# EAGLE design Adafruit ItsyBitsy M0 (EAGLE 6.4)
COMPANY: ADAFRUIT INDUSTRIES; DRAWN: KTOWN; REV: B
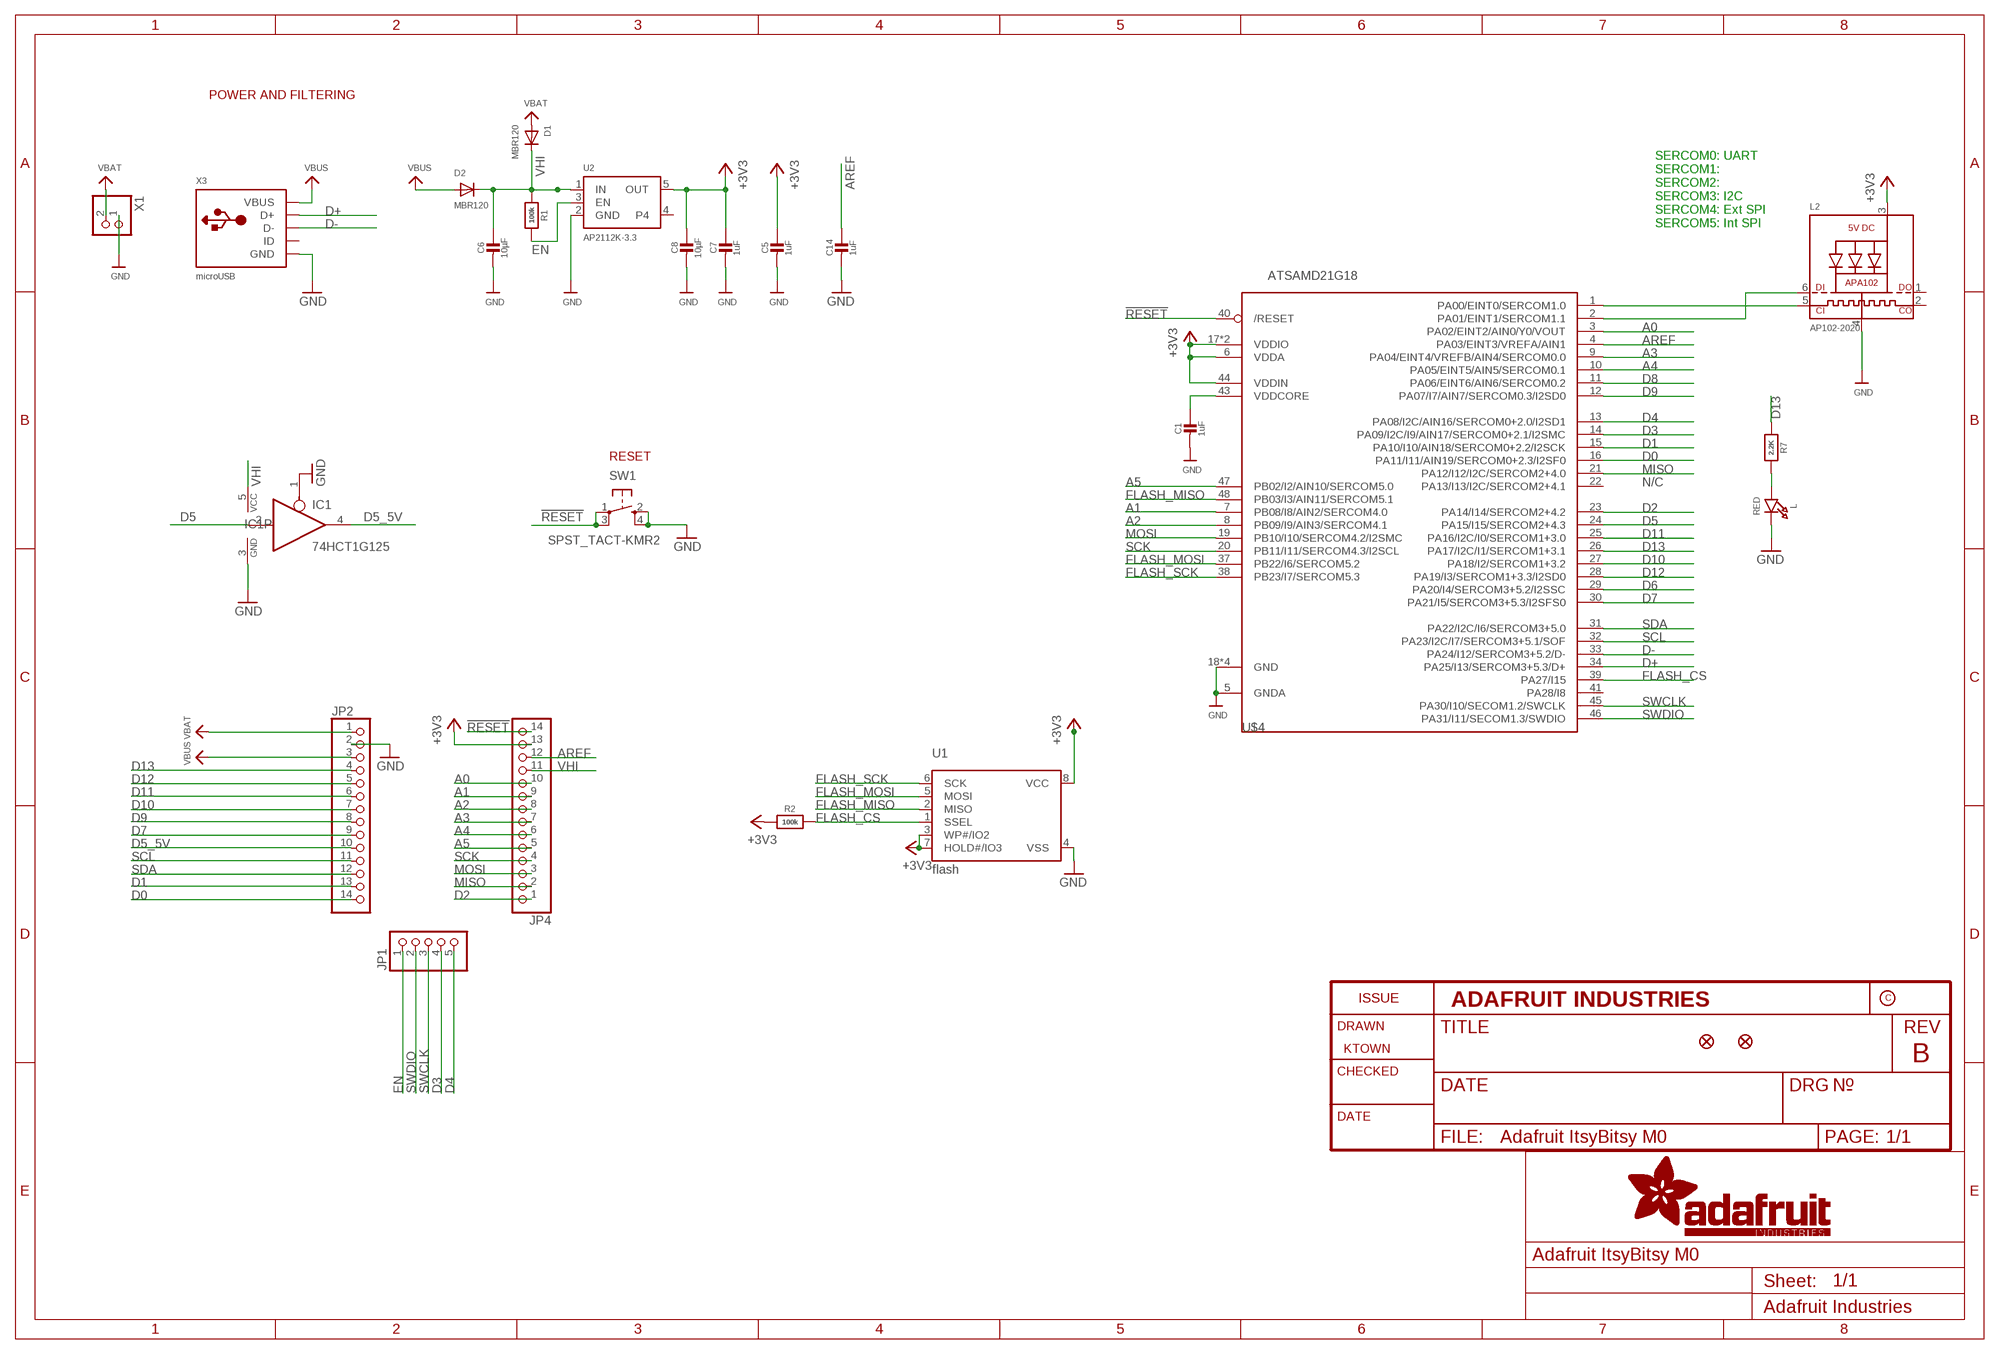
[diagram p0: schematic, sheet 1]

## Parts
C1  1uF  CAP_CERAMIC0603_NO  [0603-NO]
C5  1uF  CAP_CERAMIC0603_NO  [0603-NO]
C6  10µF  CAP_CERAMIC0805-NOOUTLINE  [0805-NO]
C7  1uF  CAP_CERAMIC0603_NO  [0603-NO]
C8  10µF  CAP_CERAMIC0805-NOOUTLINE  [0805-NO]
C14  1uF  CAP_CERAMIC0603_NO  [0603-NO]
D1  MBR120  DIODE_SOD-123FL  [SOD-123FL]
D2  MBR120  DIODE_SOD-123FL  [SOD-123FL]
IC1  74HCT1G125  74AHC1G125DBV  [SOT23-5]
JP1  HEADER-1X570MIL  [1X05_ROUND_70]
JP2  HEADER-1X14  [1X14_ROUND70]
JP4  HEADER-1X14  [1X14_ROUND70]
L  RED  LED0805_NOOUTLINE  [CHIPLED_0805_NOOUTLINE]
L2  AP102-2020  APA1022020  [APA102_2020]
R1  100k  RESISTOR_0603_NOOUT  [0603-NO]
R2  100k  RESISTOR_0603_NOOUT  [0603-NO]
R7  2.2K  RESISTOR_0603_NOOUT  [0603-NO]
SW1  SPST_TACT-KMR2  [KMR2]
U1  flash  SPIFLASH_8PINUX  [USON8]
U2  AP2112K-3.3  VREG_SOT23-5  [SOT23-5]
U$4  ATSAMD21G18  ATSAMD21G_QFN  [TQFN48_7MM]
U$34  FIDUCIAL_1MM  [FIDUCIAL_1MM]
U$35  FIDUCIAL_1MM  [FIDUCIAL_1MM]
X1  CON_JST_PH_2PIN  [JSTPH2]
X3  microUSB  USB_MICRO_20329_V2  [4UCONN_20329_V2]

## Nets
!RESET: JP4.14 SW1.1(P) SW1.3(P1) U$4.40(/RESET)
+3V3: C5.1 C7.1 C8.1 JP4.13 L2.3(VDD) R2.1 U1.3(WP#/IO2) U1.7(HOLD#/IO3) U1.8(VCC) U2.5(OUT) U$4.6(VDDA) U$4.17(VDDIO) U$4.36(VDDIO) U$4.44(VDDIN)
A0: JP4.10 U$4.3(PA02/EINT2/AIN0/Y0/VOUT)
A1: JP4.9 U$4.7(PB08/I8/AIN2/SERCOM4.0)
A2: JP4.8 U$4.8(PB09/I9/AIN3/SERCOM4.1)
A3: JP4.7 U$4.9(PA04/EINT4/VREFB/AIN4/SERCOM0.0)
A4: JP4.6 U$4.10(PA05/EINT5/AIN5/SERCOM0.1)
A5: JP4.5 U$4.47(PB02/I2/AIN10/SERCOM5.0)
AREF: C14.1 JP4.12 U$4.4(PA03/EINT3/VREFA/AIN1)
D0: JP2.14 U$4.16(PA11/I11/AIN19/SERCOM0+2.3/I2SF0)
D1: JP2.13 U$4.15(PA10/I10/AIN18/SERCOM0+2.2/I2SCK)
D2: JP4.1 U$4.23(PA14/I14/SERCOM2+4.2)
D3: JP1.4 U$4.14(PA09/I2C/I9/AIN17/SERCOM0+2.1/I2SMC)
D4: JP1.5 U$4.13(PA08/I2C/AIN16/SERCOM0+2.0/I2SD1)
D5: IC1.2(I) U$4.24(PA15/I15/SERCOM2+4.3)
D5_5V: IC1.4(O) JP2.10
D6: U$4.29(PA20/I4/SERCOM3+5.2/I2SSC)
D7: JP2.9 U$4.30(PA21/I5/SERCOM3+5.3/I2SFS0)
D8: U$4.11(PA06/EINT6/AIN6/SERCOM0.2)
D9: JP2.8 U$4.12(PA07/I7/AIN7/SERCOM0.3/I2SD0)
D10: JP2.7 U$4.27(PA18/I2/SERCOM1+3.2)
D11: JP2.6 U$4.25(PA16/I2C/I0/SERCOM1+3.0)
D12: JP2.5 U$4.28(PA19/I3/SERCOM1+3.3/I2SD0)
D13: JP2.4 R7.1 U$4.26(PA17/I2C/I1/SERCOM1+3.1)
D+: U$4.34(PA25/I13/SERCOM3+5.3/D+) X3.D+
D-: U$4.33(PA24/I12/SERCOM3+5.2/D-) X3.D-
EN: JP1.1 R1.2 U2.3(EN)
FLASH_CS: R2.2 U1.1(SSEL) U$4.39(PA27/I15)
FLASH_MISO: U1.2(MISO) U$4.48(PB03/I3/AIN11/SERCOM5.1)
FLASH_MOSI: U1.5(MOSI) U$4.37(PB22/I6/SERCOM5.2)
FLASH_SCK: U1.6(SCK) U$4.38(PB23/I7/SERCOM5.3)
GND: C1.2 C5.2 C6.2 C7.2 C8.2 C14.2 IC1.1(OE) IC1.3(GND) JP2.2 L2.4(GND) L.C SW1.2(S) SW1.4(S1) U1.4(VSS) U2.2(GND) U$4.5(GNDA) U$4.18(GND) U$4.35(GND) U$4.42(GND) U$4.THERMAL(GND) X1.1 X3.BASE@1(GND) X3.BASE@2(GND) X3.GND X3.SPRT@1(GND) X3.SPRT@2(GND) X3.SPRT@3(GND) X3.SPRT@4(GND)
MISO: JP4.2 U$4.21(PA12/I12/I2C/SERCOM2+4.0)
MOSI: JP4.3 U$4.19(PB10/I10/SERCOM4.2/I2SMC)
N$1: L2.5(CKI) U$4.1(PA00/EINT0/SERCOM1.0)
N$2: L.A R7.2
N$5: L2.6(DI) U$4.2(PA01/EINT1/SERCOM1.1)
SCK: JP4.4 U$4.20(PB11/I11/SERCOM4.3/I2SCL)
SCL: JP2.11 U$4.32(PA23/I2C/I7/SERCOM3+5.1/SOF)
SDA: JP2.12 U$4.31(PA22/I2C/I6/SERCOM3+5.0)
SWCLK: JP1.3 U$4.45(PA30/I10/SECOM1.2/SWCLK)
SWDIO: JP1.2 U$4.46(PA31/I11/SECOM1.3/SWDIO)
VBAT: D1.A JP2.1 X1.2
VBUS: D2.A JP2.3 X3.VBUS
VDDCORE: C1.1 U$4.43(VDDCORE)
VHI: C6.1 D1.C D2.C IC1.5(VCC) JP4.11 R1.1 U2.1(IN)
Unconnected: L2.1(DO) L2.2(CKO) U2.4 U$4.22(PA13/I13/I2C/SERCOM2+4.1) U$4.41(PA28/I8) X3.ID

## Notes on the sheet
- POWER AND FILTERING
- SERCOM0: UART
  SERCOM1:
  SERCOM2:
  SERCOM3: I2C
  SERCOM4: Ext SPI
  SERCOM5: Int SPI
- RESET
- N/C

## Library data of the parts
C1 C5-C8 C14 = microbuilder:CAP_CERAMIC: Ceramic Capacitors For new designs, use the packages preceded by an '_' character since they are more reliable: The following footprints should be used on most boards: _0402 - Standard footprint for regular board layouts _0603 - Standard footprint for regular board layouts _0805 - Standard footprint for regular board layouts _1206 - Standard footprint for regular board layouts For extremely tight-pitch boards where space is at a premium, the following 'micro-pitch' footprints can be used (smaller pads, no silkscreen outline, etc.): _0402MP - Micro-pitch footprint for very dense/compact boards _0603MP - Micro-pitch footprint for very dense/compact boards _0805MP - Micro-pitch footprint for very dense/compact boards _1206MP - Micro-pitch footprint for very dense/compact boards
D1 D2 = adafruit:DIODE: Diode SMADIODE - SMA Surface Mount Package 20V 1A Schottky Diode Digikey: 641-1014-6-ND DO-1N4148 - Through Hole Small Current Diode SOD-123 20V 1 A (.5mV Vf) Schottky Diode - Digikey: MBRX120TPMSCT-ND SOD-323 10V 570mA (.38mV Vf, 3ns) Schottky Diode - Digikey: ZLLS410CT-ND SOD-523 30V 30mA Schottky Diode (RB751S-40TE61) - Digikey: RB751S-40TE61CT-ND SOT23-R/W - SOT23 Package (R = Solder Paste/Reflow Ovens, W = Hand-Soldering) BAT54Film 40V 300mA - Digikey: 497-7162-1-ND
IC1 = 74xx-little-us:74*1G125: Single Bus Buffer Gate with 3-State Output
JP1 = microbuilder:HEADER-1X5: PIN HEADER
JP2 JP4 = microbuilder:HEADER-1X14
L = microbuilder:LED: LED 0603 - 0603 Surface Mount Package 2mA: Green LED - Low Power (3.9mcd, 2ma, 1.7Vf) - Digikey: 475-2709-2-ND Orange LED - Low Power (9.8mcd, 2ma, 1.8Vf) - Digikey: 475-1194-2-ND Red LED - Low Power (5mcd, 2ma, 1.8Vf) - Digikey: 475-1195-2-ND Yellow LED - Low Power (7mcd, 2ma, 1.8Vf) - Digikey: 475-1196-2-ND 5mA: Blue LED - Low Power (17mcd, 5ma, 2.9Vf) - Digikey: LNJ937W8CRACT-ND 0805 - 0805 Surface Mount Package 2mA: Red LED (8.8mcd, 2mA, 1.8Vf, Clear) - Low Power [Digikey: 475-2510-1-ND] Green LED (5mcd, 2mA, 1.8Vf, Clear) - Low Power [Digikey: 475-2730-1-ND] Yellow LED (11.3mcd, 2mA, 1.8Vf, Clear) - Low Power [Digikey: 475-2555-1-ND] 20mA: Red LED (104mcd, 20mA, Diffused) - LS R976 [Digikey: 475-1278-6-ND] Red LED (12mcd, 20mA, 2.0Vf, Clear) - APT2012EC [Digikey: 754-1128-1-ND] Green LED (15mcd, 20mA, 2.2Vf, Clear) - APT2012GC [Digikey: 754-1131-1-ND] Orange LED (160mcd, 20mA, 2.1Vf, Clear) - APT2012SECK [Digikey: 754-1130-1-ND] 1206 - 1206 Surface Mount Package Green LED (26mcd, 20mA, Diffused) - LG N971 [Digikey: 475-1407-6-ND] Red LED (15mcd, 20mA, Diffused) - LH N974 [Digikey: 475-1416-6-ND] Cree - Cree High-Power Surface Mount LEDs XPEBWT-L1-0000-00D50 - White 111lm 350mA 2.9Vf 6200K 110° XTEAWT-00-0000-00000LEE3 - White 114lm 350mA 2.85Vf 5000K 115° Everlight - Everlight 45-21 Series Surface Mount LEDs 45-21/QK2C-B2832AC2CB2/2T - Warm White 2000mcd 20mA 3.25Vf 3050K 120° 45-21/LK2C-B38452C4CB2/2T - Nuetral White 2000mcd 20mA 3.25Vf 4150K 120° 45-21/LK2C-B50634C6CB2/2T - Cold White 2200mcd 20mA 3.25Vf 5650K 120° PLCC2 Reverse Mount LS T77K-J1L2-1-0-2-R18-Z - Red 11.25mcd 2mA 1.8Vf 630nm 120° LO T77K-L1M2-24-Z - Orange 19.6mcd 2mA 1.8Vf 606nm 120° LY T77K-K2M1-26-Z - Yellow 15.7mcd 2mA 1.8Vf 587nm 120°
L2 = microbuilder:APA102: APA102/DotStar Pixels VCC: 5V DC Refresh Rate: 400Hz
R1 R2 R7 = microbuilder:RESISTOR: Resistors For new designs, use the packages preceded by an '_' character since they are more reliable: The following footprints should be used on most boards: _0402 - Standard footprint for regular board layouts _0603 - Standard footprint for regular board layouts _0805 - Standard footprint for regular board layouts _1206 - Standard footprint for regular board layouts For extremely tight-pitch boards where space is at a premium, the following 'micro-pitch' footprints can be used (smaller pads, no silkscreen outline, etc.): _0402MP - Micro-pitch footprint for very dense/compact boards _0603MP - Micro-pitch footprint for very dense/compact boards _0805MP - Micro-pitch footprint for very dense/compact boards _1206MP - Micro-pitch footprint for very dense/compact boards
SW1 = adafruit:SPST_TACT: SMT 6mm switch, EVQQ2 series http://www.ladyada.net/library/eagle
U1 = microbuilder:SPIFLASH_8PIN: SOIC8 SPI Flash Be careful with the size since SOIC8 flash comes in several 'widths' SOIC8 150 mil M25P16 - 16Mbit (2Mbit x 8) Serial Flash (75MHz SPI Bus), Supply: 2.7-3.6V Digikey: SOIC8 - M25P16-VMN6P-ND SOIC8 208 mil W25Q16BVSSIG - 16Mbit (2Mbit x 8) Serial Flash (104MHz SPI Bus), Supply: 2.7-3.6V Digikey: SOIC8 - W25Q16BVSSIG-ND
U2 = microbuilder:VREG_SOT23-5: SOT23-5 Fixed Voltage Regulators Part Current Out V Out V In V Dropout θJA (°C/W) TJ (°C) Digikey Part No. ADP121 150mA 3.3V 3.4-5.5V 0.09V @ 150mA -- -- ADP121-AUJZ33R7CT-ND ADP121 150mA 3.0V 3.1-5.5V 0.09V @ 150mA -- -- ADP121-AUJZ30R7CT-ND ADP122 300mA 3.3V 3.4-5.5V 0.085V @ 300mA -- -- ADP122AUJZ-3.3-R7CT-ND ADP1712 300mA 3.3V 3.5-5.5V 0.17V @ 300mA -- -- ADP1712AUJZ-3.3-R7TR-ND AP7311 (Low Cost) 150mA 3.3V 3.5-6V 0.15V @ 150mA -- -- AP7311-33WG-7DICT-ND LD39015M18R 150mA 1.8V 1.9V-5.5V 0.08V @ 100mA -- -- 497-6977-1-ND LP2985A-33DBVR 150mA 3.3V 3.3-16V 0.28V @ 150mA 206 150 296-18479-1-ND MCP1824T-3302E/OT 300mA 3.3V 3.5V-6V 0.2V @ 300mA -- -- MCP1824T-3302E/OTCT-ND MIC5205-2.5YM5 TR 150mA 2.5V 2.7-16V 0.165V @ 150mA -- -- 576-1257-2-ND MIC5205-3.0YM5 TR 150mA 3.0V 3.2V-16V 0.165V @ 150mA -- -- 576-1258-2-ND MIC5205-3.3YM5 TR 150mA 3.3V 3.5V-16V 0.165V @ 150mA -- -- 576-1259-2-ND TPS780330220 150mA 3.3V+2.2V 3.6-5.5V 250mV Max -- -- 296-23332-1-ND TDA3663/N1,135 100mA 3.3V 3.5-45V 0.18V @ 50mA -- -- 568-5343-1-ND Max operating temp can be calculated using θJA, TJ (max junction temperature), and power in watts. Set the "Maximum Ambient Temperature" until it reaches TJ ("Max Junction Temperature"), which is the absolute limit for safe use of the regulator: Heat Sink Temperature Calculator <http://www.daycounter.com/Calculators/Heat-Sink-Temperature-Calculator.phtml> For example, With 12V source into a 3.3V LP2985 and a 30mA load, we are dissipating (12V-3.3V) * 0.03A = 0.261W. With a θJA of 206 °C/W, a TJ of 150°C, and 261mW we can safely use the chip without a heat sink up to 75°C (=147.1°C Junction Temperature).
U$4 = microbuilder:ATSAMD21G
U$34 U$35 = microbuilder:FIDUCIAL: Fiducial Alignment Points Various fiducial points for machine vision alignment.; BOM: EXCLUDE
X1 = microbuilder:CON_JST_PH_2PIN: JST 2-Pin Right-Angle Connector PH-Series - 4UConnector: 17311 SH-Series - 4UConnector: 07278
X3 = microbuilder:USB: USB Connectors USBMINIB - Surface Mount Female Mini-B USB Connector 4UConnector: 06564

## Board
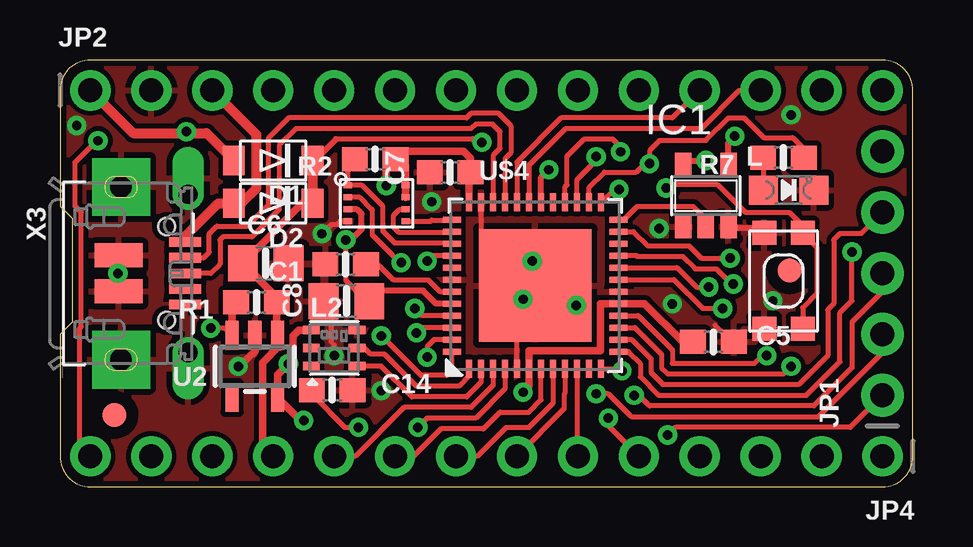
[diagram p1: board, top side]
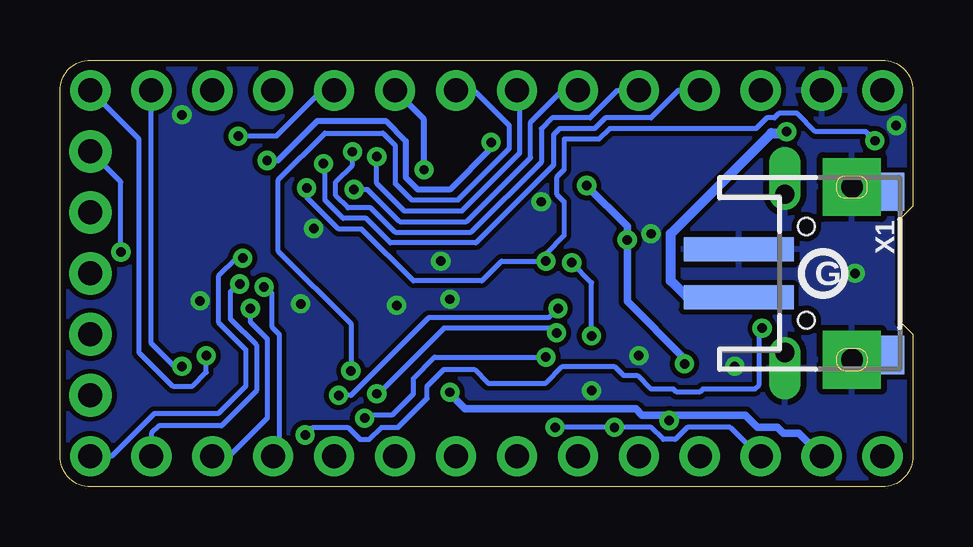
[diagram p2: board, bottom side, seen from below]

Size 35.56 x 17.78 mm. Coordinates in mm from the lower left corner, seen from the top.
Outline: 0,6.35 0,1.27 arc90 1.27,0 34.29,0 arc90 35.56,1.27 35.56,16.51 arc90 34.29,17.78 1.27,17.78 arc90 0,16.51 0,11.68 0.51,11.18 0.51,6.86 0,6.35
Copper layers (1*16): Top 0.035mm / dielectric 1.5mm / Bottom 0.035mm
Design rules "adafruit *": minimum track width 8mil, minimum drill 15.5mil, track to track 8mil, track to pad 8mil, pad to pad 8mil, via to via 8mil, smd to smd 8mil, copper to edge 10mil, drill to drill 8mil, minimum pad ring 10mil, minimum via ring 8mil, stop-mask expansion 2mil, vias tented up to drill 20mil, thermal gap 10mil

### Footprints (pad centres in the part's own frame; a part is rotated, then mirrored left to right if it is on the bottom)
0603-NO = smd 1.075 x 1: 1 -0.85,0; 2 0.85,0
0805-NO = smd 1.24 x 1.5: 1 -0.95,0; 2 0.95,0
SOD-123FL = smd 0.91 x 1.22: A 1.637,0; C -1.637,0
SOT23-5 = smd 0.69 x 0.99: 1 -0.95,-1.29; 2 0,-1.29; 3 0.95,-1.29; 4 0.95,1.3; 5 -0.95,1.3
1X05_ROUND_70 = drill 1 pad 1.778: 1 -5.08,0; 2 -2.54,0; 3 0,0; 4 2.54,0; 5 5.08,0
1X14_ROUND70 = drill 1 pad 1.676: 1 -16.51,0; 2 -13.97,0; 3 -11.43,0; 4 -8.89,0; 5 -6.35,0; 6 -3.81,0; 7 -1.27,0; 8 1.27,0; 9 3.81,0; 10 6.35,0; 11 8.89,0; 12 11.43,0; 13 13.97,0; 14 16.51,0
CHIPLED_0805_NOOUTLINE = smd 1.2 x 1.2: A 0,-1.05; C 0,1.05
APA102_2020 = smd 0.7 x 0.35: 1 -0.95,-0.75; 2 -0.95,0; 3 -0.95,0.75; 4 0.95,0.75; 5 0.95,0; 6 0.95,-0.75
KMR2 = smd 1 x 1: 1 2,0.8; 2 2,-0.8; 3 -2,0.8; 4 -2,-0.8
USON8 = smd 0.35 x 0.25: 1 -1.2,0.75; 2 -1.2,0.25; 3 -1.2,-0.25; 4 -1.2,-0.75; 5 1.2,-0.75; 6 1.2,-0.25; 7 1.2,0.25; 8 1.2,0.75
SOT23-5' = smd 0.55 x 1.2: 1 -0.95,-1.3; 2 0,-1.3; 3 0.95,-1.3; 4 0.95,1.3; 5 -0.95,1.3
TQFN48_7MM = smd 0.25 x 0.75: 1 -2.75,-3.475; 2 -2.25,-3.475; 3 -1.75,-3.475; 4 -1.25,-3.475; 5 -0.75,-3.475; 6 -0.25,-3.475; 7 0.25,-3.475; 8 0.75,-3.475; 9 1.25,-3.475; 10 1.75,-3.475; 11 2.25,-3.475; 12 2.75,-3.475; 25 2.75,3.475; 26 2.25,3.475; 27 1.75,3.475; 28 1.25,3.475; 29 0.75,3.475; 30 0.25,3.475; 31 -0.25,3.475; 32 -0.75,3.475; 33 -1.25,3.475; 34 -1.75,3.475; 35 -2.25,3.475; 36 -2.75,3.475 | smd 0.75 x 0.25: 13 3.475,-2.75; 14 3.475,-2.25; 15 3.475,-1.75; 16 3.475,-1.25; 17 3.475,-0.75; 18 3.475,-0.25; 19 3.475,0.25; 20 3.475,0.75; 21 3.475,1.25; 22 3.475,1.75; 23 3.475,2.25; 24 3.475,2.75; 37 -3.475,2.75; 38 -3.475,2.25; 39 -3.475,1.75; 40 -3.475,1.25; 41 -3.475,0.75; 42 -3.475,0.25; 43 -3.475,-0.25; 44 -3.475,-0.75; 45 -3.475,-1.25; 46 -3.475,-1.75; 47 -3.475,-2.25; 48 -3.475,-2.75 | smd 4.7 x 4.7: THERMAL 0,0
FIDUCIAL_1MM = smd 1 x 1: 1 0,0
JSTPH2 = smd 1 x 4.6: 1 -1,-3.7; 2 1,-3.7 | smd 1.6 x 3.4: NC1 -3.4,1.5; NC2 3.4,1.5
4UCONN_20329_V2 = smd 1 x 2: BASE@1 -0.75,-2; BASE@2 0.75,-2 | smd 0.4 x 1.35: D+ 0,0.775; D- -0.65,0.775; GND 1.3,0.775; ID 0.65,0.775; VBUS -1.3,0.775 | drill 0.8 pad 1.143 offset: SPRT@1 -3.3,0.9; SPRT@2 3.3,0.9 | drill 0.9 pad 2.413 square: SPRT@3 -3.6,-1.9; SPRT@4 3.6,-1.9 | hole 0.7: -1.95,0; 1.95,0

### Placement (x,y rotation side)
C1  11.91,9.27 180 top
C5  27.24,6.03 0 top
C6  8.58,9.31 0 top
C7  16.27,13.1 180 top
C8  11.94,7.73 180 top
C14  11.35,4.03 0 top
D1  8.89,13.59 180 top
D2  8.89,11.81 180 top
IC1  26.92,12.13 0 top
JP1  34.29,8.89 90 top
JP2  17.78,16.51 0 top
JP4  17.78,1.27 180 top
L  30.38,12.36 270 top
L2  11.43,5.78 0 top
R1  8.19,7.68 180 top
R2  13.14,13.65 180 top
R7  30.16,13.72 180 top
SW1  30.16,8.57 270 top
U1  13.21,11.81 0 top
U2  AP2112K-3.3  [SOT23-5']  8.13,5.02 180 top
U$4  19.81,8.38 0 top
U$13  [PCBFEAT-REV-040]  3.75,8.89 0 bottom
U$14  [ITSYM0_TOP]  0,0 0 top
U$15  [ITSYM0_BOT]  35.56,0 0 bottom
U$34  30.42,9.02 270 top
U$35  2.27,2.99 270 top
X1  3.56,8.89 270 bottom
X3  4.45,8.89 270 top

### Tracks (layer width: path | path; a pad name or v marks a point on that pad's centre or on a via)
!RESET  (via drill 0.39)
  Top 0.203: SW1.1 30.96,7.47 31.56,8.06 31.56,9.97 SW1.3 30.96,10.88 30.42,11.43 28.57,11.43 27.43,12.57 25.4,12.57 v25.27,12.45 | U$4.40 15.54,9.63 v15.3,9.4 | JP4.14 0.83,1.71 0.83,6.6 0.89,6.67 0.89,11.43 0.64,11.68 0.64,13.53 1.52,14.41 v1.59,14.41
  Bottom 0.203: v25.27,12.45 25.27,12.06 23.94,10.73 22.99,10.73 20.83,8.57 17.97,8.57 17.14,9.4 v15.3,9.4 15.3,9.72 14.54,10.48 14.54,11.87 14.86,12.19 14.86,12.89 14.54,13.21 14.54,14.48 13.08,14.48 12.64,14.92 6.54,14.92 6.1,15.37 5.78,15.37 5.59,15.56 4.83,15.56 4.06,14.8 1.97,14.8 v1.59,14.41
+3V3  (via drill 0.39)
  Top 0.203: R2.1 14.26,13.39 14.41,13.39 | 12.78,7.73 C8.1 | 13.44,8.17 13.01,7.73 C8.1 | v11.91,10.29 11.91,8.6 12.78,7.73 C8.1
  Top 0.254: U$4.44 15.67,7.63 15.14,8.17 13.44,8.17 | U1.3 12.38,11.56 12.57,11.37 12.57,10.73 12.13,10.29 v11.91,10.29 | 12.46,7.73 C8.1
  Top 0.305: v19.3,3.94 19.56,4.2 U$4.6 19.56,5.66 22.53,5.66 22.53,7.63 U$4.17 24.37,7.63 25.97,6.03 C5.1 | U1.7 U1.8 14.41,13.39 | L2.3 9.96,6.53 9.72,6.29 9.72,5.31 v9.53,5.12 9.08,4.67 U2.5 10.04,2.76 v10.16,2.76 | v13.6,12.55 13.6,13.26 R2.1 14.31,13.97 16.83,13.97 17.12,13.68 C7.1 17.06,13.04 U$4.36
  Bottom 0.203: 19.3,3.87 v19.3,3.94
  Bottom 0.305: JP4.13 4.76,2.22 5.4,2.22 5.65,2.48 6.48,2.48 6.99,2.98 10.03,2.98 10.16,2.86 | 19.3,3.87 18.67,3.24 11.56,3.24 11.3,2.98 10.29,2.98 10.16,2.86 | v13.6,12.55 11.91,10.86 v11.91,10.29 11.91,7.72 9.53,5.33 v9.53,5.12 | 10.16,2.86 v10.16,2.76
A0
  Top 0.203: U$4.3 18.06,4.22 17.14,3.3 14.35,3.3 12.32,1.27 JP4.10
A1
  Top 0.203: JP4.9 14.73,1.27 15.88,2.41 17.65,2.41 18.35,3.11 19.56,3.11 20.06,3.62 U$4.7
A2
  Top 0.203: U$4.8 20.56,3.48 19.56,2.48 18.61,2.48 17.4,1.27 JP4.8
A3
  Top 0.203: U$4.9 21.06,3.92 21.02,3.87 21.02,3.24 JP4.7
A4
  Top 0.203: U$4.10 21.56,1.27 JP4.6
A5  (via drill 0.39)
  Top 0.203: U$4.47 15.59,6.13 15.3,5.84 v15.3,5.4 | JP4.5 22.86,2.54 v22.86,2.86
  Bottom 0.203: v15.3,5.4 19.94,5.4 20.83,4.51 20.83,3.87 21.72,2.98 22.73,2.98 v22.86,2.86
AREF  (via drill 0.39)
  Top 0.203: U$4.4 18.56,4.08 17.34,2.86 15.3,2.86 v14.92,2.48 | C14.1 10.5,3.85 11.87,2.48 v12.45,2.48
  Bottom 0.203: v14.92,2.48 v12.45,2.48 10.92,2.48 10.41,1.97 9.91,1.97 9.4,2.48 7.62,2.48 6.41,1.27 JP4.12
D0  (via drill 0.39)
  Top 0.203: U$4.16 24.11,7.13 25.53,5.71 25.53,5.14 28.96,5.14 29.27,5.46 v29.46,5.46
  Bottom 0.203: JP2.14 32.26,14.48 32.26,5.59 30.86,4.19 30.04,4.19 29.46,4.76 v29.46,5.46
D1  (via drill 0.39)
  Top 0.203: U$4.15 23.98,6.63 25.08,5.52 25.08,4.95 25.34,4.7 30.16,4.7 v30.48,5.02
  Bottom 0.203: JP2.13 31.75,5.97 30.8,5.02 v30.48,5.02
D2  (via drill 0.39)
  Top 0.203: U$4.23 23.91,10.63 24.51,10.03 26.23,10.03 26.73,9.53 v27.94,9.53
  Bottom 0.203: v27.94,9.53 28.19,9.53 28.96,8.76 28.96,6.86 27.81,5.71 27.81,4.19 28.96,3.05 31.62,3.05 33.4,1.27 JP4.1 33.91,1.27
D3
  Top 0.203: JP1.4 33.4,10.54 32.51,10.54 32.26,10.29 32.26,7.62 32,7.37 32,5.46 30.8,4.25 25.15,4.25 24.64,4.76 24.64,5.33 23.84,6.13 U$4.14
D4  (via drill 0.39)
  Top 0.203: U$4.13 23.7,5.63 24.19,5.14 24.19,4.57 24.96,3.81 31.11,3.81 32.51,5.21 32.51,7.24 33.02,7.75 v33.02,9.78
  Bottom 0.203: v33.02,9.78 33.02,12.7 JP1.5
D5
  Top 0.203: U$4.24 23.52,11.13 24.07,11.68 26.42,11.68 26.92,11.18 IC1.2
D5_5V  (via drill 0.39)
  Top 0.254: IC1.4 27.87,14.35 v28.13,14.61
  Bottom 0.203: JP2.10 24.64,16.51 26.54,14.61 v28.13,14.61
D7  (via drill 0.39)
  Top 0.254: U$4.30 20.06,12.89 v20.38,13.21
  Bottom 0.254: v20.38,13.21 20.38,15.3 JP2.9
D9  (via drill 0.39)
  Top 0.203: U$4.12 23.35,4.91 v23.43,4.83
  Bottom 0.203: 18.61,16.51 JP2.8 18.54,16.51 18.48,16.45 18.22,16.45 16.83,15.05 16.83,14.1 18.99,11.94 20.89,11.94 21.59,12.64 21.59,14.22 22.1,14.73 24.51,14.73 26.48,12.76 26.48,9.84 23.43,6.79 v23.43,4.83
D10  (via drill 0.39)
  Top 0.203: U$4.27 21.56,12.8 22.35,13.59 v22.35,13.75
  Bottom 0.203: v22.35,13.75 22.35,12.64 21.21,11.49 18.8,11.49 16.38,13.91 16.38,16.38 JP2.7
D11  (via drill 0.39)
  Top 0.203: U$4.25 23.09,12.38 v23.3,12.38
  Bottom 0.203: v23.3,12.38 22.73,12.38 21.4,11.05 18.61,11.05 15.94,13.72 15.94,15.18 14.61,16.51 JP2.6
D12  (via drill 0.39)
  Top 0.203: v23.37,13.96 23.37,14.16 23.05,14.48 21.84,14.48 21.14,13.78 21.14,12.57 21.06,12.49 U$4.28
  Bottom 0.203: JP2.5 12.32,16.51 13.46,15.37 15.05,15.37 15.49,14.92 15.49,13.53 18.41,10.6 21.59,10.6 22.61,11.62 23.56,11.62 24.07,12.13 24.07,12.7 23.37,13.4 v23.37,13.96
D13  (via drill 0.39)
  Top 0.203: U$4.26 22.06,12.47 22.7,13.11 24.03,13.11 24.38,13.46 v24.57,13.46 24.57,13.99 25.01,14.43 26.94,14.43 27.88,15.37 28.51,15.37 29.34,14.54 30.54,14.54 31.01,14.07 R7.1
  Bottom 0.203: JP2.4 9.78,16.51 10.92,15.37 12.83,15.37 13.27,14.92 14.73,14.92 14.99,14.67 14.99,13.4 18.22,10.16 21.78,10.16 22.8,11.18 23.75,11.18 24.51,11.94 24.51,13.4 v24.57,13.46
D+
  Top 0.203: X3.D+ 6.29,8.89 6.67,9.27 6.67,10.29 6.79,10.41 8,10.41 9.14,11.56 9.14,14.22 9.84,14.92 17.14,14.92 17.34,15.11 18.03,15.11 18.35,14.8 18.35,14.1 18.06,13.81 U$4.34
D-
  Top 0.203: X3.D- 5.98,9.54 6.22,9.78 6.22,10.54 6.54,10.86 7.81,10.86 8.7,11.75 8.7,14.54 9.53,15.37 16.95,15.37 17.14,15.56 18.29,15.56 18.8,15.05 18.8,13.91 18.56,13.67 U$4.33
EN  (via drill 0.39)
  Top 0.203: JP1.1 32.96,2.48 25.65,2.48 v25.34,2.16 | U2.3 6.89,6.6 v6.29,6.6
  Top 0.305: U2.3 7.18,7.68 R1.2
  Bottom 0.203: v25.34,2.16 25.02,2.48 23.56,2.48 23.05,1.97 22.67,1.97 22.16,2.48 21.46,2.48 20.26,3.68 20.26,4.19 19.56,4.89 18.29,4.89 17.72,4.32 15.3,4.32 14.61,5.02 12.45,5.02 12.06,4.64 11.49,4.64 10.92,4.06 9.98,4.06 9.86,3.94 8.89,3.94 8.76,4.06 6.6,4.06 6.41,4.25 6.41,6.48 v6.29,6.6
FLASH_CS
  Top 0.203: R2.2 12.01,13.37 U1.1 12.59,12.56 13.46,11.68 13.46,10.64 13.95,10.16 16.34,10.16 U$4.39
FLASH_MISO  (via drill 0.39)
  Top 0.203: v13.4,6.29 15.05,4.64 16.13,4.64 16.34,4.84 U$4.48 | U1.2 12.5,12.06 13.02,11.54 13.02,10.49 14.17,9.34 v14.22,9.34
  Bottom 0.203: v13.4,6.29 13.4,8.51 v14.22,9.34
FLASH_MOSI
  Top 0.203: U1.5 15.44,11.06 15.49,11.11 16.32,11.11 U$4.37
FLASH_SCK
  Top 0.203: U$4.38 16.31,10.6 14.11,10.6 13.91,10.81 13.91,11.3 14.16,11.56 U1.6
GND  (via drill 0.39)
  Top 0.203: U$4.35 17.56,8.26 | U$4.5 19.06,7.5 | C5.2 28,6.03 27.3,6.73 | X3.GND 5.41,7.59 | 19.81,8.51 19.81,9.27 v19.68,9.4 | v11.43,5.46 11.43,5.91 | v19.3,7.81 19.3,8.38 U$4.THERMAL | C8.2 arc-90 11.3,7.36 11.3,6.03 | U1.4 11.7,11.06 11.56,10.92 11.3,10.92 v10.92,10.54
  Top 0.254: SW1.4 29.14,10.79 27.87,10.79 IC1.3
  Top 0.305: U2.2 8.13,5.65 7.81,5.33
  other vias: 30.48,15.49 29.72,7.75 24.98,10.76 2.41,8.89 21.53,7.56 15.49,11.87 13.4,4 25.53,7.62 7.43,5.02 0.7,15.05
  pour Top: 0,17.78 0,0 35.56,0 35.56,17.78
  pour Bottom: 35.56,0.13 0,0 0,17.78 35.56,17.78
MISO  (via drill 0.39)
  Top 0.203: v28.07,8.45 28,8.45 27.37,9.08 26.48,9.08 25.97,9.59 24.07,9.59 24.02,9.63 U$4.21
  Bottom 0.203: JP4.2 31.75,2.22 31.43,2.54 28.83,2.54 27.37,4 27.37,5.91 28.45,6.99 28.45,8.13 28.13,8.45 v28.07,8.45
MOSI  (via drill 0.39)
  Top 0.203: v27.62,7.43 26.8,7.43 25.59,8.63 U$4.19
  Bottom 0.203: v27.62,7.43 27.62,6.86 26.92,6.16 26.92,2.86 28.51,1.27 JP4.3
N$1
  Top 0.203: U$4.1 17.06,4.62 16.64,4.19 14.86,4.19 13.53,5.52 12.95,5.52 12.7,5.78 L2.5
N$2
  Top 0.203: R7.2 29.32,13.73 L.A
N$5
  Top 0.203: U$4.2 17.56,4.35 16.95,3.75 14.67,3.75 13.39,5.03 L2.6
SCK  (via drill 0.39)
  Top 0.203: v27.05,8.32 26.54,8.32 25.72,9.14 25.71,9.13 U$4.20
  Bottom 0.203: JP4.4 26.42,1.52 26.42,6.35 26.73,6.67 26.73,8.06 26.99,8.32 v27.05,8.32
SCL
  Top 0.203: JP2.11 25.53,15.37 20.89,15.37 19.05,13.53 19.06,13.51 U$4.32
SDA
  Top 0.203: JP2.12 28.32,16.51 26.73,14.92 21.08,14.92 19.56,13.4 U$4.31
SWCLK  (via drill 0.39)
  Top 0.203: JP1.3 34.29,8.13 33.02,6.86 33.02,4.95 31.43,3.37 24.57,3.37 24.13,3.81 v23.94,3.81 | U$4.45 15.09,7.13 v14.8,7.43
  Bottom 0.203: v14.8,7.43 15.18,7.05 20.19,7.05 23.43,3.81 v23.94,3.81
SWDIO  (via drill 0.39)
  Top 0.203: JP1.2 34.29,5.59 31.62,2.92 23.81,2.92 22.86,3.87 v22.35,3.87 | U$4.46 15.08,6.63 v14.86,6.41
  Bottom 0.203: 22.48,3.87 v22.35,3.87 22.29,3.87 19.56,6.6 15.05,6.6 v14.86,6.41
VBAT  (via drill 0.39)
  Top 0.406: JP2.1 3.05,14.73 5.27,14.73 | 5.27,14.73 6.11,14.73 D1.A | v5.27,14.8 5.27,14.73
  Bottom 0.406: X1.2 9.41,7.89 10.1,8.57 10.1,10.54 5.91,14.73 5.33,14.73 v5.27,14.8
VBUS
  Top 0.406: X3.VBUS 5.22,10.43 6.6,11.81 D2.A 7.56,11.81 8.19,12.45 8.19,14.67 JP2.3
VDDCORE
  Top 0.203: C1.1 13.25,9.27 13.91,8.61 15.37,8.61 15.85,8.13 U$4.43
VHI  (via drill 0.39)
  Top 0.203: 17.21,14.48 11.5,14.48 | IC1.5 26.13,13.59 | 9.14,5.87 9.08,5.87
  Top 0.254: v17.59,14.35 17.34,14.35 17.21,14.48 | 26.13,13.59 v26.92,13.59 | 11.5,14.48 10.74,13.72
  Top 0.305: JP4.11 8.45,1.71 8.45,5.17 9.14,5.87 | 10.74,13.72 10.61,13.59 | D2.C 10.1,11.81 7.63,9.34 C6.1 9.04,7.9 R1.1 9.04,6.35 U2.1
  Top 0.406: D2.C D1.C 10.61,13.59 | U2.1 9.14,6.32 9.14,5.87
  Bottom 0.254: v26.92,13.59 26.48,13.59 24.83,15.24 21.97,15.24 21.14,14.41 21.14,12.89 20.64,12.38 19.3,12.38 17.59,14.1 v17.59,14.35